# EAGLE design DRIVER (EAGLE 6.4)
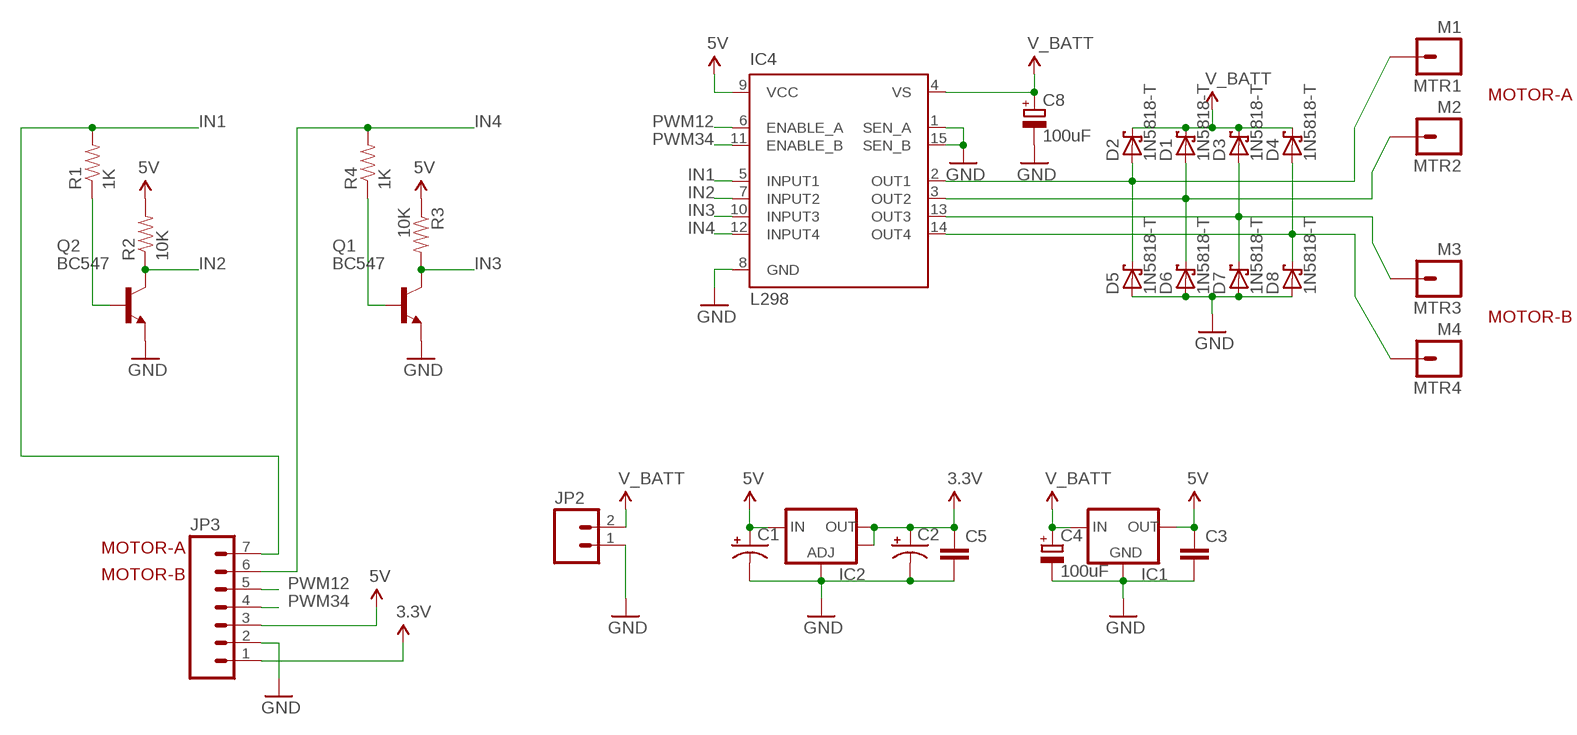
[diagram p0: schematic, sheet 1]

## Parts
C1  CAP_POL1206-KIT  [EIA3216-KIT]
C2  CAP_POL1206-KIT  [EIA3216-KIT]
C3  CAPPTH  [CAP-PTH-SMALL]
C4  100uF  CPOL-EUE2.5-5  [E2,5-5]
C5  CAP0805  [0805]
C8  100uF  CPOL-EUE2.5-5  [E2,5-5]
D1  1N5818-T  [DO41-7.6]
D2  1N5818-T  [DO41-7.6]
D3  1N5818-T  [DO41-7.6]
D4  1N5818-T  [DO41-7.6]
D5  1N5818-T  [DO41-7.6]
D6  1N5818-T  [DO41-7.6]
D7  1N5818-T  [DO41-7.6]
D8  1N5818-T  [DO41-7.6]
IC1  V_REG_78XX-TO-220  [TO-220-ALT]
IC2  V_REG_LM1117SOT223  [SOT223]
IC4  L298  [MULTIWATT-15]
JP2  M02LOCK_LONGPADS  [1X02_LOCK_LONGPADS]
JP3  M07LONGPADS  [1X07_LONGPADS]
MTR1  M1  M01PTH_LONGPAD  [1X01_LONGPAD]
MTR2  M2  M01PTH_LONGPAD  [1X01_LONGPAD]
MTR3  M3  M01PTH_LONGPAD  [1X01_LONGPAD]
MTR4  M4  M01PTH_LONGPAD  [1X01_LONGPAD]
Q1  BC547  [TO92]
Q2  BC547  [TO92]
R1  1K  RESISTOR0805-RES  [0805]
R2  10K  RESISTOR0805-RES  [0805]
R3  10K  RESISTOR0805-RES  [0805]
R4  1K  RESISTOR0805-RES  [0805]

## Nets
3.3V: C2.A(+) C5.1 IC2.2(OUT) IC2.4(OUT) JP3.1
5V: C1.A(+) C3.1 IC1.OUT IC2.3(IN) IC4.9(VCC) JP3.3 R2.2 R3.1
GND: C1.C(-) C2.C(-) C3.2 C4.- C5.2 C8.- D5.A D6.A D7.A D8.A IC1.GND IC2.1(ADJ) IC4.1(SEN_A) IC4.8(GND) IC4.15(SEN_B) JP2.1 JP3.2 Q1.1(E) Q2.1(E)
IN1: IC4.5(INPUT1) JP3.7 R1.2
IN2: IC4.7(INPUT2) Q2.3(C) R2.1
IN3: IC4.10(INPUT3) Q1.3(C) R3.2
IN4: IC4.12(INPUT4) JP3.6 R4.2
N$4: Q2.2(B) R1.1
N$5: Q1.2(B) R4.1
N$7: D2.A D5.C IC4.2(OUT1) MTR1.1
N$8: D1.A D6.C IC4.3(OUT2) MTR2.1
N$9: D3.A D7.C IC4.13(OUT3) MTR3.1
N$10: D4.A D8.C IC4.14(OUT4) MTR4.1
PWM12: IC4.6(ENABLE_A) JP3.5
PWM34: IC4.11(ENABLE_B) JP3.4
V_BATT: C4.+ C8.+ D1.C D2.C D3.C D4.C IC1.IN IC4.4(VS) JP2.2

## Notes on the sheet
- MOTOR-A
- MOTOR-B
- MOTOR-A
- MOTOR-B

## Library data of the parts
C1 C2 = SparkFun-Passives:CAP_POL: Capacitor Polarized These are standard SMD and PTH capacitors. Normally 10uF, 47uF, and 100uF in electrolytic and tantalum varieties. Always verify the external diameter of the through hole cap, it varies with capacity, voltage, and manufacturer. The EIA devices should be standard.
C3 C5 = SparkFun-Passives:CAP: Capacitor Standard 0603 ceramic capacitor, and 0.1" leaded capacitor.
C4 C8 = resistor:CPOL-EU: POLARIZED CAPACITOR, European symbol
D1-D8 = diode:1N581*: 1.0A SCHOTTKY BARRIER RECTIFIER Source: http://www.diodes.com/datasheets/ds23001.pdf
IC1 = SparkFun-PowerIC:V_REG_78XX: Voltage Regulator Standard 7805 5V regulator. IGO (Input Ground Output). Spark Fun Electronics SKU : COM-00107
IC2 = SparkFun-PowerIC:V_REG_LM1117: Voltage Regulator LM1117 Standard adjustable voltage regulator but in SMD form. Spark Fun Electronics SKU : COM-00595
IC4 = st-microelectronics:L298: DUAL FULL-BRIDGE DRIVER; MPN: L298N; OC_FARNELL: 1589425; OC_NEWARK: 32M1527
JP2 = SparkFun-Connectors:M02: Header 2 Standard 2-pin 0.1" header. Use with straight break away headers (SKU : PRT-00116), right angle break away headers (PRT-00553), swiss pins (PRT-00743), machine pins (PRT-00117), and female headers (PRT-00115). Molex polarized connector foot print use with SKU : PRT-08233 with associated crimp pins and housings.
JP3 = SparkFun-Connectors:M07: Header 7 Standard 7-pin 0.1" header. Use with straight break away headers (SKU : PRT-00116), right angle break away headers (PRT-00553), swiss pins (PRT-00743), machine pins (PRT-00117), and female headers (PRT-00115). NOTES ON THE VARIANTS LOCK and LOCK_LONGPADS... This footprint was designed to help hold the alignment of a through-hole component (i.e. 7-pin header) while soldering it into place. You may notice that each hole has been shifted either up or down by 0.005 of an inch from it's more standard position (which is usually a perfectly straight line). This slight alteration caused the pins (the squares in the middle) to touch the edges of the holes. Because they are alternating, it causes a "brace" to hold the header in place. 0.005 has proven to be the perfect amount of "off-center" position when using our standard breakaway headers. Although looks a little odd when you look at the bare footprint, once you have a header in there, the alteration is very hard to notice. Also, if you push a header all the way into place, it is covered up entirely on the bottom side. This idea of altering the position of holes to aid alignment will be further integrated into the Sparkfun Library for other footprints. It can help hold any component with 3 or more connection pins.
MTR1-MTR4 = SparkFun-Connectors:M01: Header 1 Standard 1-pin 0.1" header. Use with straight break away headers (SKU : PRT-00116), right angle break away headers (PRT-00553), swiss pins (PRT-00743), machine pins (PRT-00117), and female headers (PRT-00115).
Q1 Q2 = transistor:BC547: NPN TRANSISTOR
R1-R4 = SparkFun-Passives:RESISTOR: Resistor Basic schematic elements and footprints for 0603, 1206, and PTH resistors.

## Board
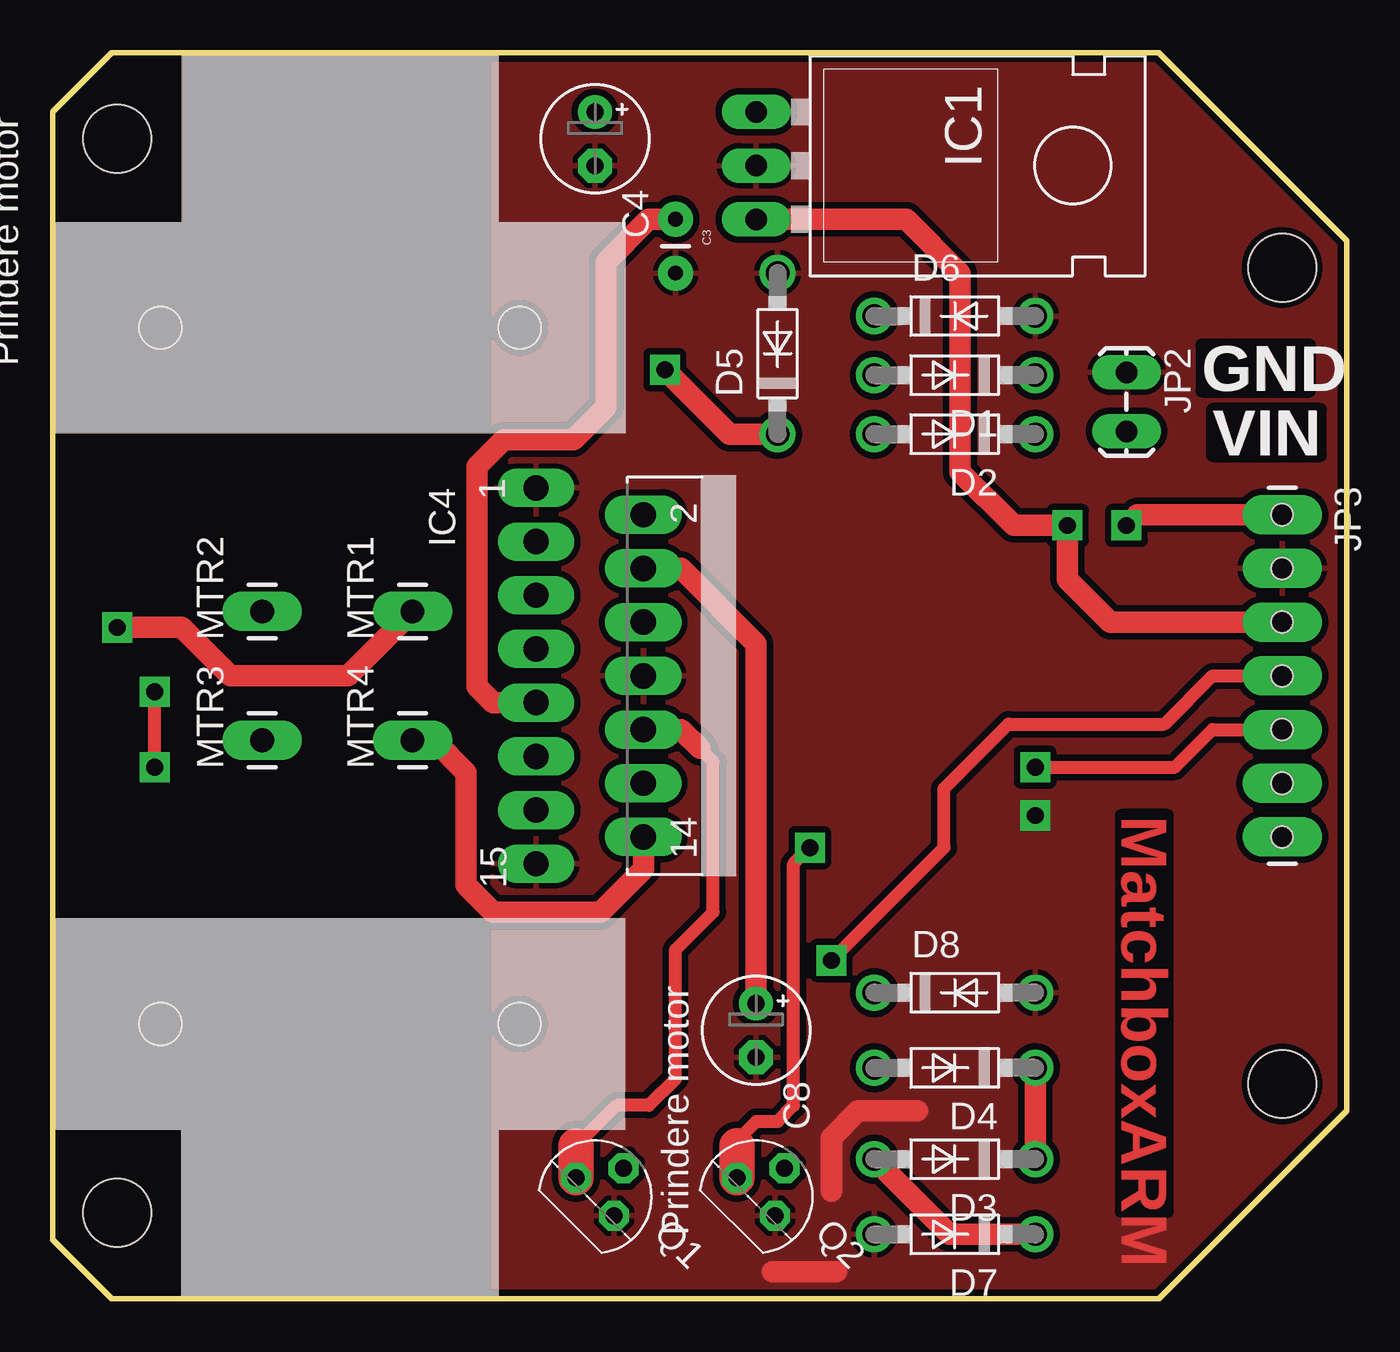
[diagram p1: board, top side]
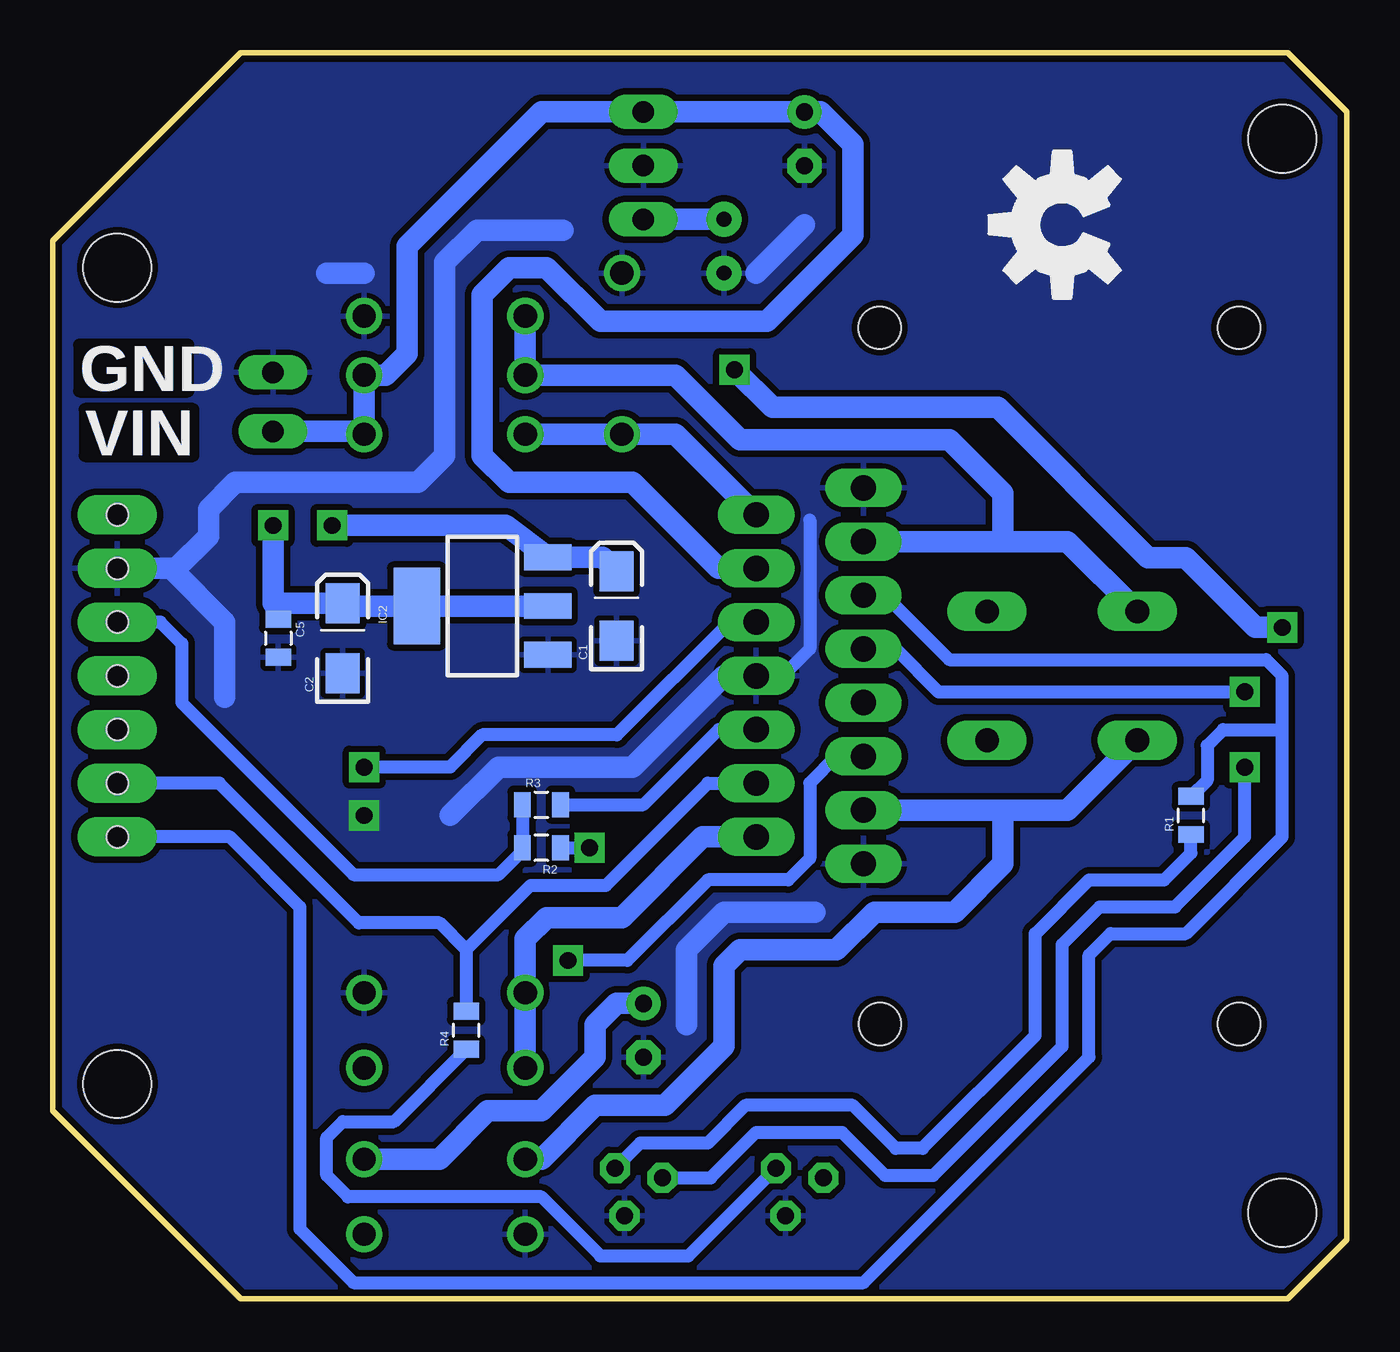
[diagram p2: board, bottom side, seen from below]

Size 61.21 x 58.93 mm. Coordinates in mm from the lower left corner, seen from the top.
Outline: 52.32,58.93 2.79,58.93 0,56.13 0,2.79 2.79,0 52.32,0 61.21,8.89 61.21,50.04 52.32,58.93
Copper layers (1*16): Top 0.035mm / dielectric 1.5mm / Bottom 0.035mm
Design rules "default *": minimum track width 8mil, minimum drill 20mil, track to track 10mil, track to pad 8mil, pad to pad 8mil, via to via 8mil, smd to smd 8mil, copper to edge 10mil, drill to drill 8mil, minimum pad ring 12mil, minimum via ring 10mil, stop-mask expansion 4mil, vias tented up to drill 25mil, thermal gap 10mil
Holes 3.2 mm at 3.05,54.86 58.17,10.16 58.17,48.77 3.05,4.06

### Footprints (pad centres in the part's own frame; a part is rotated, then mirrored left to right if it is on the bottom)
EIA3216-KIT = smd 1.9 x 1.6: A 1.65,0; C -1.65,0
CAP-PTH-SMALL = drill 0.7 pad 1.651: 1 0,0; 2 2.54,0
E2,5-5 = drill 0.813 pad 1.6: + -1.27,0 | drill 0.813 pad 1.6 octagon: - 1.27,0
0805 = smd 0.8 x 1.2: 1 -0.9,0; 2 0.9,0
DO41-7.6 = drill 1.1 pad 1.7: A 3.81,0; C -3.81,0
TO-220-ALT = drill 1.016 long: GND 0,-3.81; IN -2.54,-3.81; OUT 2.54,-3.81
SOT223 = smd 1.219 x 2.235: 1 -2.311,-3.099; 2 0,-3.099; 3 2.311,-3.099 | smd 3.6 x 2.2: 4 0,3.099
MULTIWATT-15 = drill 1.2 long: 1 -8.89,-7.62; 2 -7.62,-2.54; 3 -6.35,-7.62; 4 -5.08,-2.54; 5 -3.81,-7.62; 6 -2.54,-2.54; 7 -1.27,-7.62; 8 0,-2.54; 9 1.27,-7.62; 10 2.54,-2.54; 11 3.81,-7.62; 12 5.08,-2.54; 13 6.35,-7.62; 14 7.62,-2.54; 15 8.89,-7.62
1X02_LOCK_LONGPADS = drill 1.016 long: 1 -0.127,0; 2 2.667,0
1X07_LONGPADS = drill 1.016 pad 1.88 long: 1 0,0; 2 2.54,0; 3 5.08,0; 4 7.62,0; 5 10.16,0; 6 12.7,0; 7 15.24,0 | hole 1.016: 0,0; 2.54,0; 5.08,0; 7.62,0; 10.16,0; 12.7,0; 15.24,0
1X01_LONGPAD = drill 1.118 pad 1.88 long: 1 0,0
TO92 = drill 0.813 octagon: 1 1.27,0; 2 0,1.905; 3 -1.27,0
MOTOR = hole 2: 13,-1; 13,16

### Placement (x,y rotation side)
C1  34.54,32.77 90 bottom
C2  47.5,31.24 90 bottom
C3  29.46,51.05 270 top
C4  25.65,54.86 270 top
C5  50.55,31.24 270 bottom
C8  33.27,12.7 270 top
D1  42.67,43.69 180 top
D2  42.67,40.89 180 top
D3  42.67,6.6 180 top
D4  42.67,10.92 180 top
D5  34.29,44.7 90 top
D6  42.67,46.48 0 top
D7  42.67,3.05 180 top
D8  42.67,14.48 0 top
IC1  37.08,53.59 270 top
IC2  40.89,32.77 90 bottom
IC4  30.48,29.46 270 top
JP2  50.8,43.69 270 top
JP3  58.17,37.08 270 top
MTR1  17.02,32.51 90 top
MTR2  9.91,32.51 90 top
MTR3  9.91,26.42 90 top
MTR4  17.02,26.42 90 top
Q1  25.65,4.83 315 top
Q2  33.27,4.83 315 top
R1  7.37,22.86 90 bottom
R2  38.1,21.34 180 bottom
R3  38.1,23.37 0 bottom
R4  41.66,12.7 90 bottom
U$1  [MOTOR]  6.1,58.93 270 top
U$3  [MOTOR]  21.08,0 90 top
U$13  [OSHW-LOGO-L]  13.46,50.8 90 bottom
U$14  [CREATIVE_COMMONS]  5.84,-12.19 0 top  (outside the outline)

### Tracks (layer width: path | path; a pad name or v marks a point on that pad's centre or on a via)
3.3V  (via drill 0.8 pad 1.42)
  Top 1.016: JP3.1 51.31,37.08 v50.8,36.58
  Bottom 0.813: C5.1 50.55,32.89
  Bottom 1.016: IC2.2 IC2.4 47.5,32.77 C2.A 50.55,32.89 50.8,32.89 v50.8,36.58
5V  (via drill 0.8 pad 1.42)
  Top 1.016: IC4.9 20.83,28.19 20.07,28.96 20.07,39.37 21.34,40.64 24.64,40.64 26.16,42.16 26.16,49.02 28.19,51.05 C3.1 | IC1.OUT 40.39,51.05 42.93,48.51 42.93,39.12 45.47,36.58 v48.01,36.58 48.01,34.04 50.04,32 JP3.3
  Bottom 0.61: R3.1 R2.2 39,21.2 40.13,20.07 46.99,20.07 55.12,28.19 55.12,30.99 56.13,32 JP3.3
  Bottom 1.016: C3.1 IC1.OUT | C1.A 35.2,35.08 IC2.3 39.8,36.58 v48.01,36.58
GND  (via drill 0.8 pad 1.42)
  Top 1.016: 36.83,5.08 36.83,7.62 38.1,8.89 40.89,8.89 | 34.04,1.27 37.08,1.27
  Bottom 0.61: 25.4,36.83 25.4,30.73 26.67,29.46 IC4.8
  Bottom 1.016: 25.65,50.8 27.94,48.51 | 25.15,18.29 29.46,18.29 31.24,16.51 31.24,12.95 | IC4.8 29.46,29.46 33.78,25.15 40.13,25.15 42.42,22.86 | 53.09,28.45 53.09,32 55.63,34.54 | 37.08,50.55 41.15,50.55 42.67,49.02 42.67,39.88 43.94,38.61 52.58,38.61 53.85,37.34 53.85,36.07 55.37,34.54 55.63,34.54 | JP3.2 55.63,34.54 | 46.48,48.51 48.26,48.51
  other vias: 46.48,22.86
  pour Top (isolate 0.305): 20.83,58.93 52.32,58.93 61.21,50.04 61.21,8.89 52.32,0 20.83,0
  pour Bottom (isolate 0.305): 2.79,58.93 52.32,58.93 61.21,50.04 61.21,8.89 52.32,0 2.79,0 0,2.79 0,56.13
IN1
  Bottom 0.61: 3.05,26.92 3.05,21.84 7.62,17.27 11.18,17.27 12.19,16.26 12.19,11.43 22.86,0.76 46.99,0.76 49.53,3.3 49.53,18.54 52.83,21.84 JP3.7 | 3.05,26.92 3.05,29.46 3.81,30.23 18.8,30.23 21.84,33.27 IC4.5 | 3.05,26.92 5.84,26.92 6.6,26.16 6.6,24.52 R1.2
IN2  (via drill 0.8 pad 1.42)
  Top 0.61: v35.81,21.34 35.05,20.57 35.05,9.14 34.29,8.38 33.27,8.38 32.38,7.48 32.38,7.23 | v4.83,25.15 v4.83,28.7
  Top 1.676: Q2.3 32.38,7.23
  Bottom 0.61: v4.83,25.15 4.83,21.84 8.13,18.54 11.68,18.54 13.46,16.76 13.46,11.94 19.56,5.84 21.84,5.84 23.88,7.87 27.94,7.87 30.09,5.72 Q2.3 | R2.1 v35.81,21.34 | IC4.7 21.34,30.73 19.3,28.7 v4.83,28.7
IN3
  Top 0.61: 30.61,26.04 31.24,25.4 31.24,18.29 29.46,16.51 29.46,10.41 28.19,9.14 26.67,9.14 24.76,7.23
  Top 1.016: 30.61,26.04 29.72,26.92 IC4.10
  Top 1.676: Q1.3 24.76,7.23
  Bottom 0.61: R3.2 33.27,23.37 29.72,26.92 IC4.10
IN4
  Bottom 0.61: 41.66,16.51 38.61,19.56 35.05,19.56 30.23,24.38 IC4.12 | 41.66,16.51 R4.2 | 41.66,16.51 42.93,17.78 46.74,17.78 53.34,24.38 JP3.6
N$4
  Bottom 0.61: R1.1 7.37,21.08 8.64,19.81 12.19,19.81 14.73,17.27 14.73,12.45 20.07,7.11 21.34,7.11 23.37,9.14 28.45,9.14 30.23,7.37 33.43,7.37 Q2.2
N$5
  Bottom 0.61: R4.1 45.07,8.38 47.5,8.38 48.26,7.62 48.26,5.84 47.24,4.83 38.1,4.83 35.31,2.03 31.14,2.03 Q1.2
N$7  (via drill 0.8 pad 1.42)
  Top 1.016: MTR1.1 13.97,29.46 8.38,29.46 6.1,31.75 v3.05,31.75 | v28.96,43.94 32,40.89 D5.C
  Bottom 1.016: D2.A D5.C 31.75,40.89 IC4.2 | v28.96,43.94 27.18,42.16 16.51,42.16 9.4,35.05 7.62,35.05 4.32,31.75 v3.05,31.75
N$8
  Bottom 1.016: D6.C D1.A 31.75,43.69 28.7,40.64 18.8,40.64 16.26,38.1 16.26,35.81 | MTR2.1 13.21,35.81 16.26,35.81 | IC4.3 16.26,35.81
N$9
  Top 1.016: D3.A 42.42,3.05 D7.C
  Bottom 1.016: D3.A 38.1,6.6 35.56,9.14 32.26,9.14 29.46,11.94 29.46,15.75 28.7,16.51 24.13,16.51 22.35,18.29 18.54,18.29 16.26,20.57 16.26,23.11 | MTR3.1 13.21,23.11 16.26,23.11 | 16.26,23.11 IC4.13
N$10
  Top 1.016: MTR4.1 18.03,26.42 19.56,24.89 19.56,19.56 20.83,18.29 25.91,18.29 27.94,20.32 IC4.14
  Bottom 1.016: D4.A D8.C 38.86,17.02 37.85,18.03 34.29,18.03 30.48,21.84 IC4.14
PWM12  (via drill 0.8 pad 1.42)
  Top 0.61: v46.48,25.15 53.09,25.15 54.86,26.92 JP3.5
  Bottom 0.61: IC4.6 29.21,32 34.54,26.67 40.89,26.67 42.42,25.15 v46.48,25.15
PWM34  (via drill 0.8 pad 1.42)
  Top 0.61: v36.83,16 42.16,21.34 42.16,24.13 45.21,27.18 52.58,27.18 54.86,29.46 JP3.4
  Bottom 0.61: IC4.11 24.13,25.65 25.4,24.38 25.4,20.83 26.42,19.81 30.23,19.81 34.04,16 v36.83,16
V_BATT
  Top 1.016: D4.C D3.C | C8.+ 33.27,30.99 29.72,34.54 IC4.4
  Bottom 1.016: C8.+ 34.54,13.97 35.56,12.95 35.56,11.43 38.1,8.89 40.64,8.89 42.93,6.6 D3.C | IC4.4 29.72,34.54 33.78,38.61 39.62,38.61 40.89,39.88 40.89,47.5 39.62,48.77 37.85,48.77 35.31,46.23 27.43,46.23 23.37,50.29 23.37,54.61 24.89,56.13 C4.+ IC1.IN 38.1,56.13 44.45,49.78 44.45,44.7 45.47,43.69 D1.C D2.C 46.48,41.02 JP2.2

### Text on the board
Top: GND | VIN | MatchboxARM
Bottom: GND | VIN
tPlace: GND | VIN
bPlace: GND | VIN
tValues: Nedelcu Bogdan Sebastian